# EAGLE design balance (EAGLE 6.5.0)
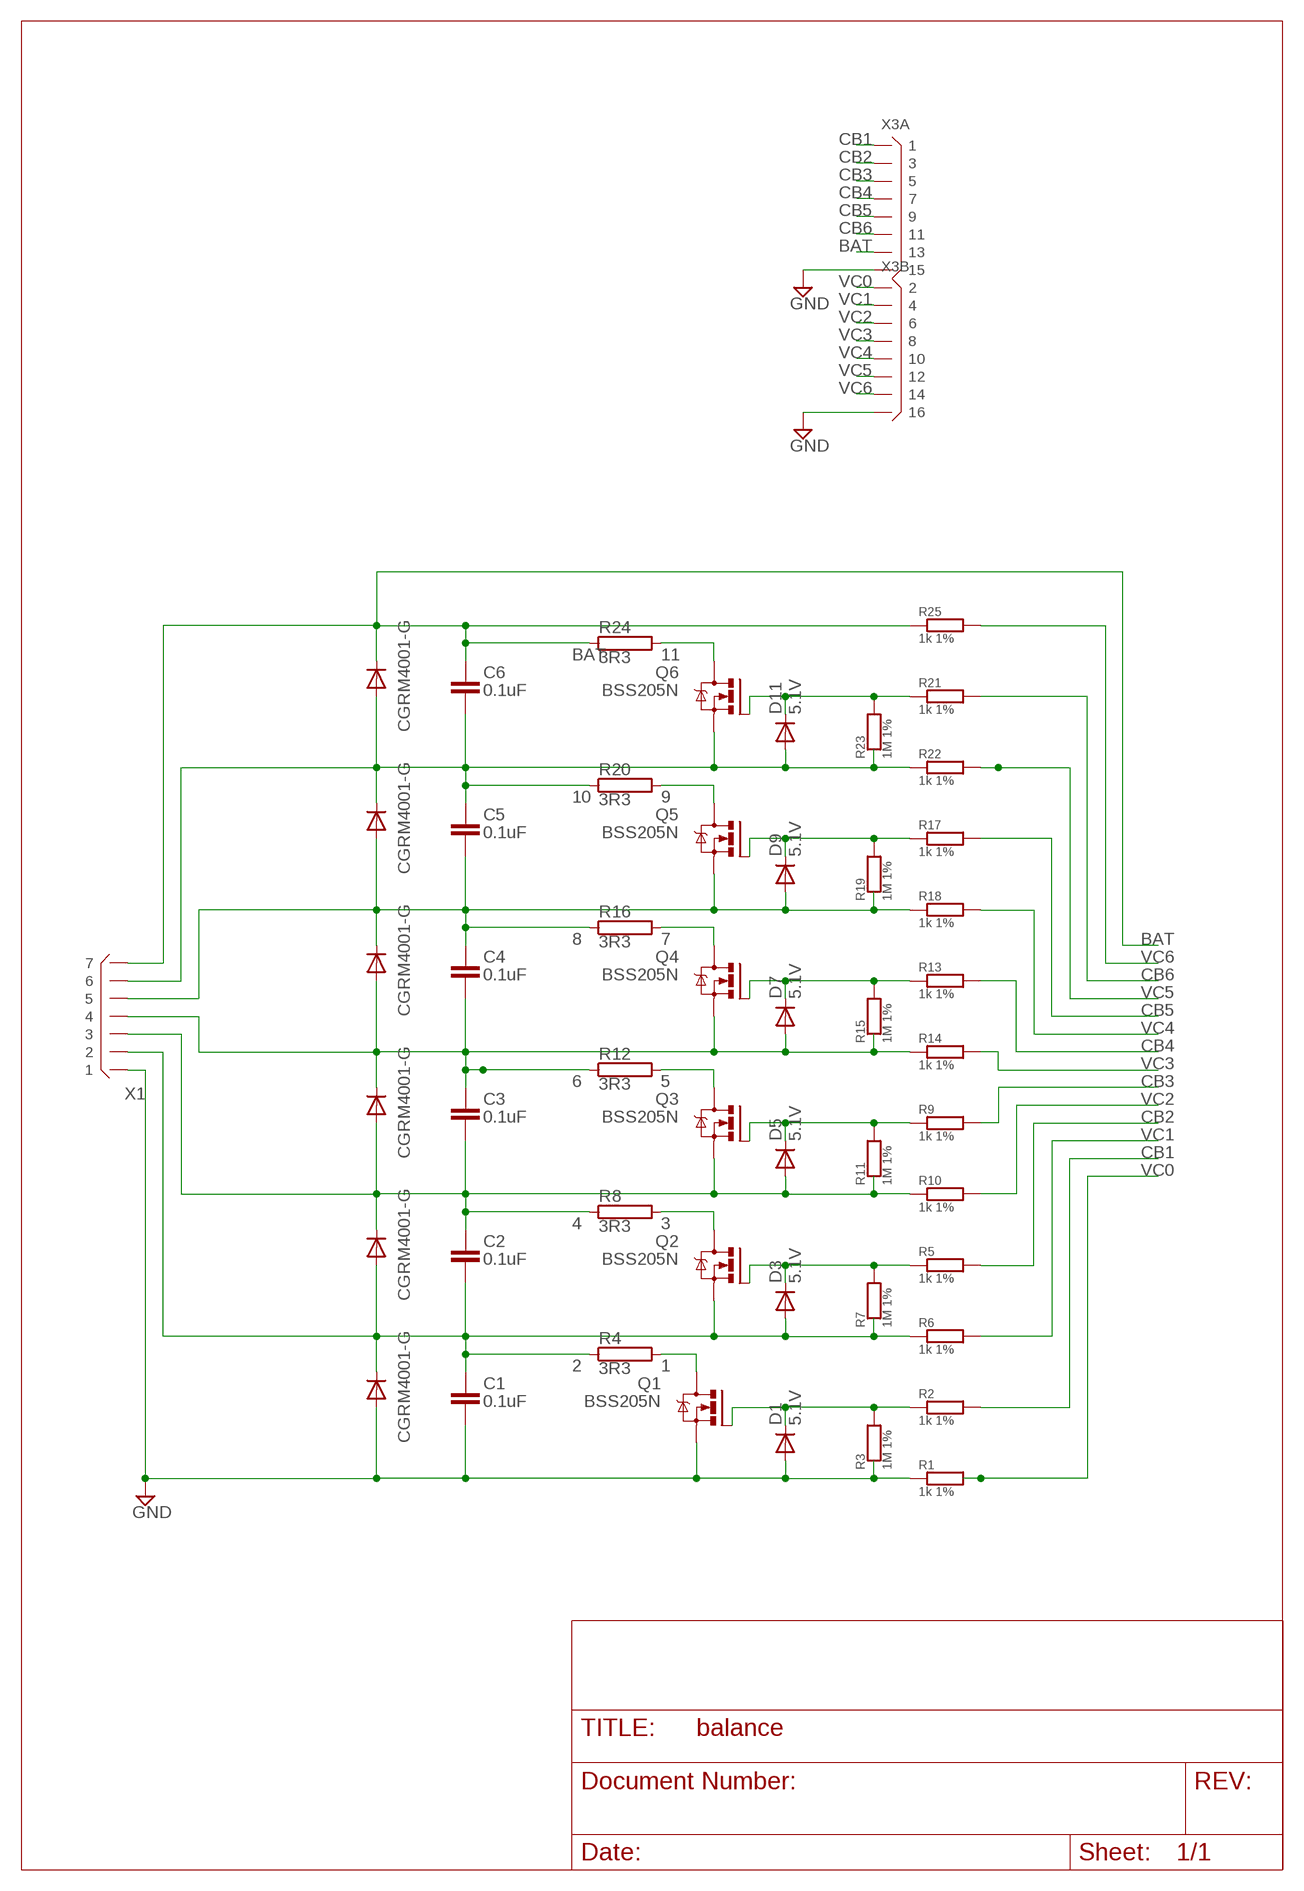
[diagram p0: schematic, sheet 1]

## Parts
C1  0.1uF  CSTD  [C0805]
C2  0.1uF  CSTD  [C0805]
C3  0.1uF  CSTD  [C0805]
C4  0.1uF  CSTD  [C0805]
C5  0.1uF  CSTD  [C0805]
C6  0.1uF  CSTD  [C0805]
D1  5.1V  DIODESOD  [SOD-323]
D2  CGRM4001-G  [SOD-123_MINI-SMA]
D3  5.1V  DIODESOD  [SOD-323]
D4  CGRM4001-G  [SOD-123_MINI-SMA]
D5  5.1V  DIODESOD  [SOD-323]
D6  CGRM4001-G  [SOD-123_MINI-SMA]
D7  5.1V  DIODESOD  [SOD-323]
D8  CGRM4001-G  [SOD-123_MINI-SMA]
D9  5.1V  DIODESOD  [SOD-323]
D10  CGRM4001-G  [SOD-123_MINI-SMA]
D11  5.1V  DIODESOD  [SOD-323]
D12  CGRM4001-G  [SOD-123_MINI-SMA]
Q1  BSS205N  [SOT23]
Q2  BSS205N  [SOT23]
Q3  BSS205N  [SOT23]
Q4  BSS205N  [SOT23]
Q5  BSS205N  [SOT23]
Q6  BSS205N  [SOT23]
R1  1k 1%  R  [R0805]
R2  1k 1%  R  [R0805]
R3  1M 1%  R  [R0805]
R4  3R3  R  [HS15]
R5  1k 1%  R  [R0805]
R6  1k 1%  R  [R0805]
R7  1M 1%  R  [R0805]
R8  3R3  R  [HS15]
R9  1k 1%  R  [R0805]
R10  1k 1%  R  [R0805]
R11  1M 1%  R  [R0805]
R12  3R3  R  [HS15]
R13  1k 1%  R  [R0805]
R14  1k 1%  R  [R0805]
R15  1M 1%  R  [R0805]
R16  3R3  R  [HS15]
R17  1k 1%  R  [R0805]
R18  1k 1%  R  [R0805]
R19  1M 1%  R  [R0805]
R20  3R3  R  [HS15]
R21  1k 1%  R  [R0805]
R22  1k 1%  R  [R0805]
R23  1M 1%  R  [R0805]
R24  3R3  R  [HS15]
R25  1k 1%  R  [R0805]
X1  B7B-XH  [B7B-XH]
X3  X08X2DR  [X16R-DIL]

## Nets
1: Q1.3(D) R4.2
2: C1.2 C2.1 D2.C D3.2(A) D4.A Q2.2(S) R4.1 R6.1 R7.1 X1.P$2
3: Q2.3(D) R8.2
4: C2.2 C3.1 D4.C D5.2(A) D6.A Q3.2(S) R8.1 R10.1 R11.1 X1.P$3
5: Q3.3(D) R12.2
6: C3.2 C4.1 D6.C D7.2(A) D8.A Q4.2(S) R12.1 R14.1 R15.1 X1.P$4
7: Q4.3(D) R16.2
8: C4.2 C5.1 D8.C D9.2(A) D10.A Q5.2(S) R16.1 R18.1 R19.1 X1.P$5
9: Q5.3(D) R20.2
10: C5.2 C6.1 D10.C D11.2(A) D12.A Q6.2(S) R20.1 R22.1 R23.1 X1.P$6
11: Q6.3(D) R24.2
BAT: C6.2 D12.C R24.1 R25.1 X1.P$7 X3.13
CB1: R2.2 X3.1
CB2: R5.2 X3.3
CB3: R9.2 X3.5
CB4: R13.2 X3.7
CB5: R17.2 X3.9
CB6: R21.2 X3.11
GND: C1.1 D1.2(A) D2.A Q1.2(S) R1.1 R3.1 X1.P$1 X3.15 X3.16
N$2: D1.1(C) Q1.1(G) R2.1 R3.2
N$4: D3.1(C) Q2.1(G) R5.1 R7.2
N$8: D5.1(C) Q3.1(G) R9.1 R11.2
N$12: D7.1(C) Q4.1(G) R13.1 R15.2
N$17: D9.1(C) Q5.1(G) R17.1 R19.2
N$21: D11.1(C) Q6.1(G) R21.1 R23.2
VC0: R1.2 X3.2
VC1: R6.2 X3.4
VC2: R10.2 X3.6
VC3: R14.2 X3.8
VC4: R18.2 X3.10
VC5: R22.2 X3.12
VC6: R25.2 X3.14

## Library data of the parts
C1-C6 = useful:C
D1 D3 D5 D7 D9 D11 = SparkFun:DIODE: Diode These are standard reverse protection diodes and small signal diodes. SMA package can handle up to about 1A. SOD-323 can handle about 200mA. What the SOD-323 package when ordering, there are some mfgs out there that are 5-pin packages.
D2 D4 D6 D8 D10 D12 = diode:CGRM400*-G: Molded plasitc,JEDEC SOD-123/Mini SMA Source: Comchip CGRM4001-G.pdf
Q1-Q6 = infineon:BSS205N: Infineon Small Signal Transistor, OptiMOS 2 Technology, 20V, 2.5A SOT23
R1-R3 R5-R7 R9-R11 R13-R15 R17-R19 R21-R23 R25 = useful:R
R4 R8 R12 R16 R20 R24 = special:R
X1 = con-jst-xh:?7B-XH
X3 = connectors:X08X2: Connector 2x8 pins

## Board
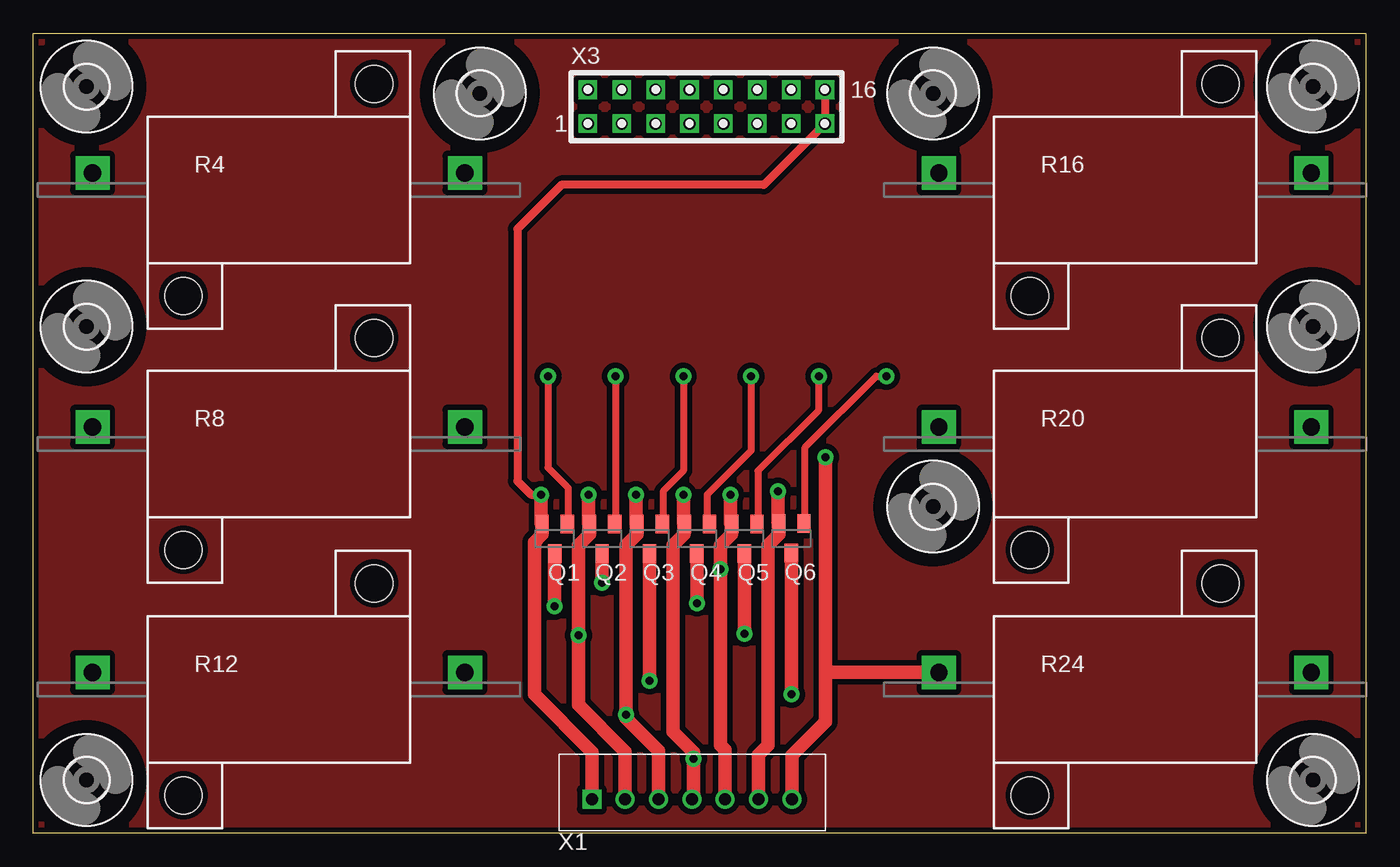
[diagram p1: board, top side]
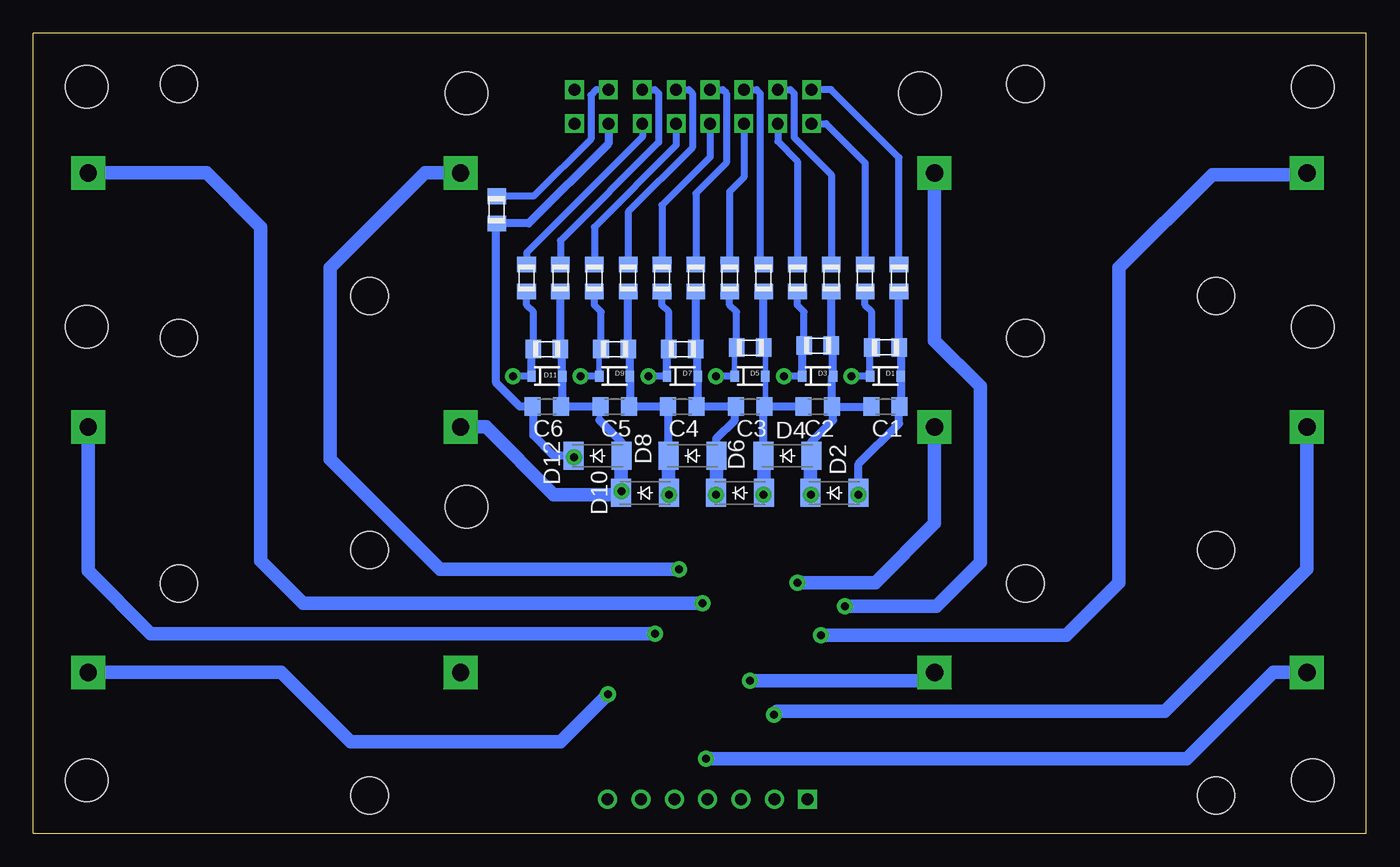
[diagram p2: board, bottom side, seen from below]

Size 100 x 60 mm. Coordinates in mm from the lower left corner, seen from the top.
Outline: 0,0 0,60 100,60 100,0 0,0
Copper layers (1+2*15+16): Top 0.035mm / dielectric 0.2mm / Route2 0.035mm / dielectric 0.5mm / Route15 0.035mm / dielectric 0.2mm / Bottom 0.035mm
Design rules "ats_35u_4layer_2 *": minimum track width 10mil, minimum drill 0.2mm, track to track 10mil, track to pad 10mil, pad to pad 10mil, via to via 10mil, smd to smd 10mil, copper to edge 0.3mm, drill to drill 8mil, minimum pad ring 10mil, minimum via ring 0.2mm, stop-mask expansion 4mil, vias tented up to drill 0mil, thermal gap 10mil

### Footprints (pad centres in the part's own frame; a part is rotated, then mirrored left to right if it is on the bottom)
C0805 = smd 1.2 x 1.4: 1 -1.066,0; 2 1.066,0
SOD-323 = smd 0.63 x 0.83: 1 -1.15,0; 2 1.15,0
SOD-123_MINI-SMA = smd 1.5 x 2.1: A 1.8,0; C -1.8,0
SOT23 = smd 1 x 1.4: 1 -0.95,-1.1; 2 0.95,-1.1; 3 0,1.1
R0805 = smd 1.168 x 1.397: 1 -1.016,0; 2 1.016,0
HS15 = drill 1.3 pad 2.54 square: 1 -13.97,1.27; 2 13.97,1.27 | hole 2.8: -7.15,-7.95; 7.15,7.95
3,2 = hole 3.2: 0,0
B7B-XH = drill 0.9 pad 1.422 square: P$1 0,0 | drill 0.9 pad 1.422: P$2 2.5,0; P$3 5,0; P$4 7.5,0; P$5 10,0; P$6 12.5,0; P$7 15,0
X16R-DIL = drill 0.889 pad 1.397 square: 1 -8.89,-1.27; 2 -8.89,1.27; 3 -6.35,-1.27; 4 -6.35,1.27; 5 -3.81,-1.27; 6 -3.81,1.27; 7 -1.27,-1.27; 8 -1.27,1.27; 9 1.27,-1.27; 10 1.27,1.27; 11 3.81,-1.27; 12 3.81,1.27; 13 6.35,-1.27; 14 6.35,1.27; 15 8.89,-1.27; 16 8.89,1.27

### Placement (x,y rotation side)
C1  36.07,32 180 bottom
C2  41.15,32 180 bottom
C3  46.23,32 180 bottom
C4  51.31,32 180 bottom
C5  56.39,32 180 bottom
C6  61.47,32 180 bottom
D1  36.07,34.29 0 bottom
D2  39.88,25.53 0 bottom
D3  41.15,34.29 0 bottom
D4  43.43,28.32 0 bottom
D5  46.23,34.29 0 bottom
D6  46.99,25.53 0 bottom
D7  51.31,34.29 0 bottom
D8  50.55,28.32 0 bottom
D9  56.39,34.29 0 bottom
D10  54.1,25.53 0 bottom
D11  61.47,34.29 0 bottom
D12  57.66,28.32 0 bottom
Q1  39.12,22.1 180 top
Q2  42.67,22.1 180 top
Q3  46.23,22.1 180 top
Q4  49.78,22.1 180 top
Q5  53.34,22.1 180 top
Q6  56.87,22.13 180 top
R1  35.05,41.66 90 bottom
R2  37.59,41.66 90 bottom
R3  36.07,36.45 180 bottom
R4  18.41,48.26 0 top
R5  42.67,41.66 90 bottom
R6  40.13,41.66 90 bottom
R7  41.15,36.58 180 bottom
R8  18.41,29.21 0 top
R9  47.75,41.66 90 bottom
R10  45.21,41.66 90 bottom
R11  46.22,36.44 180 bottom
R12  18.41,10.79 0 top
R13  52.83,41.66 90 bottom
R14  50.29,41.66 90 bottom
R15  51.31,36.32 180 bottom
R16  81.92,48.26 0 top
R17  57.91,41.66 90 bottom
R18  55.37,41.66 90 bottom
R19  56.39,36.32 180 bottom
R20  81.92,29.21 0 top
R21  62.99,41.66 90 bottom
R22  60.45,41.66 90 bottom
R23  61.47,36.32 180 bottom
R24  81.92,10.79 0 top
R25  65.24,46.77 90 bottom
U$1  [3,2]  4,4 0 top
U$2  [3,2]  4,56 0 top
U$3  [3,2]  96,4 0 top
U$4  [3,2]  96,56 0 top
U$5  [3,2]  67.5,55.5 0 top
U$6  [3,2]  33.5,55.5 0 top
U$7  [3,2]  67.5,24.5 0 top
U$8  [3,2]  4,38 0 top
U$9  [3,2]  96,38 0 top
X1  41.91,2.54 0 top
X3  50.5,54.5 0 top

### Tracks (layer width: path | path; a pad name or v marks a point on that pad's centre or on a via)
1  (via drill 0.6)
  Top 1.016: Q1.3 v39.12,17.02
  Bottom 1.016: v39.12,17.02 32.26,17.02 28.96,20.32 28.96,33.53 32.38,36.96 R4.2
2  (via drill 0.6)
  Top 1.016: v41.66,25.4 41.66,23.26 Q2.2 41.72,22.42 40.89,21.59 v40.89,14.86 40.89,9.65 44.41,6.14 X1.P$2
  Bottom 0.406: 40,36.44 R7.1 | 41.59,25.44 D2.C | 41.68,28.28 D4.A | 40.01,31.93 C2.1 | 40.08,34.21 D3.2
  Bottom 0.508: 41.59,25.44 41.62,25.44 v41.66,25.4
  Bottom 0.61: R7.1 R6.1 | D3.2 40,36.44 | C1.2 C2.1 40.08,34.21 | D4.A 41.63,29.36 40.01,30.99 40.01,31.93
  Bottom 1.016: D2.C 41.68,28.28 | v40.89,14.86 22.48,14.86 18.54,18.8 18.54,42.42 11.56,49.4 4.57,49.4 R4.1
3  (via drill 0.6)
  Top 1.016: Q2.3 v42.67,18.8
  Bottom 1.016: v42.67,18.8 36.83,18.8 32.38,23.24 R8.2
4  (via drill 0.6)
  Top 1.016: v45.21,25.4 45.21,23.26 Q3.2 45.28,22.42 44.45,21.59 v44.45,8.89 44.45,8.64 46.91,6.18 X1.P$3
  Bottom 0.406: R11.1 45.08,36.31 D5.2 45.08,32.09 C3.1 45.23,31.93 | 45.19,28.28 D4.C
  Bottom 0.508: D6.A 45.19,25.42 v45.21,25.4 | 45.21,40.89 45.21,40.88 R10.1
  Bottom 0.61: R11.1 45.21,40.89 | C2.2 C3.1 | D4.C 45.23,31.93
  Bottom 1.016: D6.A 45.19,28.28 | v44.45,8.89 44.2,9.14 15.11,9.14 4.45,19.81 R8.1
5  (via drill 0.6)
  Top 1.016: Q3.3 v46.23,11.43
  Bottom 1.016: v46.23,11.43 33.02,11.43 R12.2
6  (via drill 0.6)
  Top 1.016: v48.77,25.4 48.77,23.26 Q4.2 48.83,22.42 48.01,21.59 48.01,7.62 49.53,6.1 v49.53,5.59 49.53,2.66 X1.P$4
  Bottom 0.406: 50.16,36.19 R15.1 | 50.16,32.09 C4.1 | 48.75,25.57 D6.C | 47.37,31.93 C3.2
  Bottom 0.508: D6.C 48.79,25.42 v48.77,25.4
  Bottom 0.61: R15.1 R14.1 | 50.16,36.19 D7.2 50.16,32.09 | C3.2 C4.1 | D8.A 48.75,29.61 47.37,30.99 47.37,31.93
  Bottom 1.016: D8.A 48.75,25.57 | v49.53,5.59 13.46,5.59 6.99,12.06 R12.1
7  (via drill 0.6)
  Top 1.016: Q4.3 v49.78,17.27
  Bottom 1.016: v49.78,17.27 79.76,17.27 82.93,20.45 82.93,45.47 87,49.53 R16.2
8  (via drill 0.6)
  Top 1.016: v52.32,25.4 52.32,23.26 Q5.2 52.39,22.42 51.56,21.59 v51.56,19.81 51.56,6.6 51.91,6.26 X1.P$5
  Bottom 0.406: 55.24,36.19 R19.1 | 55.24,32.09 C5.1 | 52.35,31.98 C4.2
  Bottom 0.508: v52.32,25.4 52.3,25.42 D10.A 52.35,25.57 52.35,25.82
  Bottom 0.61: R19.1 R18.1 | 55.24,36.19 D9.2 55.24,32.09 | C4.2 C5.1 | D8.C 52.35,31.98
  Bottom 1.016: D8.C 52.35,25.82 | R16.1 70.61,49.53 77.72,42.42 77.72,28.07 69.47,19.81 v51.56,19.81
9  (via drill 0.6)
  Top 1.016: Q5.3 v53.34,14.99
  Bottom 1.016: v53.34,14.99 91.19,14.99 95.89,19.68 R20.2
10  (via drill 0.6)
  Top 0.406: Q6.2 55.88,23.23 55.88,23.39
  Top 1.016: v55.88,25.65 55.88,23.39 | X1.P$6 54.41,5.9 55.12,6.6 55.12,21.59 55.95,22.42 55.95,23.23 Q6.2
  Bottom 0.406: 60.32,36.19 R23.1 | 60.32,32.09 C6.1 | 55.9,28.28 D12.A | 55.81,25.44 D10.C | 57.53,30.99 57.53,31.93 C5.2
  Bottom 0.508: 55.81,25.44 55.81,25.59 v55.88,25.65
  Bottom 0.61: R23.1 R22.1 | 60.32,36.19 D11.2 60.32,32.09 | C5.2 C6.1 | D12.A 55.86,29.32 57.53,30.99
  Bottom 1.016: 55.9,28.28 D10.C 56.03,25.4 60.96,25.4 66.04,30.48 R20.1
11  (via drill 0.6)
  Top 1.016: Q6.3 56.87,10.44 v56.9,10.41
  Bottom 1.016: v56.9,10.41 60.45,6.86 76.2,6.86 81.41,12.06 R24.2
BAT  (via drill 0.6)
  Top 1.016: v59.44,28.19 59.44,12.06 | 59.44,12.06 59.44,8.38 56.91,5.86 X1.P$7 | R24.1 59.44,12.06
  Bottom 0.406: 62.48,31.95 C6.2
  Bottom 0.508: R25.1 65.28,45.71 65.28,45.46
  Bottom 0.61: C6.2 63.5,32 65.28,33.78 65.28,45.46 | D12.C 60.96,28.32 62.48,29.84 62.48,31.95 | X3.13 56.85,51.73 62.83,45.75 R25.1
  Bottom 1.016: D12.C 59.44,28.3 v59.44,28.19
CB1
  Bottom 0.508: X3.1 40.53,53.23 37.59,50.29 R2.2
CB2
  Bottom 0.508: X3.3 44.15,51.9 42.67,50.42 R5.2
CB3
  Bottom 0.508: X3.5 46.69,49.2 47.75,48.13 R9.2
CB4
  Bottom 0.508: X3.7 49.23,50.72 52.83,47.12 R13.2
CB5
  Bottom 0.508: X3.9 51.77,51.61 57.91,45.47 R17.2
CB6
  Bottom 0.508: X3.11 54.31,52.24 62.99,43.56 R21.2
GND  (via drill 0.6)
  Top 0.61: X3.16 X3.15 54.8,48.64 39.62,48.64 36.32,45.34 36.32,26.42 37.34,25.4 v38.1,25.4
  Top 1.016: v38.1,25.4 38.1,23.26 Q1.2 38.17,22.42 37.59,21.84 37.59,10.41 41.91,6.1 X1.P$1
  Bottom 0.406: 34.92,32.09 C1.1 35.05,31.95 | 38.03,25.48 D2.A
  Bottom 0.508: 38.03,25.48 38.03,25.47 v38.1,25.4 | 34.92,36.44 34.92,36.45 R3.1
  Bottom 0.61: R3.1 R1.1 | 34.92,36.44 D1.2 34.92,32.09 | D2.A 38.08,27.71 35.05,30.73 35.05,31.95
N$1
  pour Top (isolate 0.406): 0,60 100,60 100,0 0,0
N$2  (via drill 0.6)
  Top 0.406: Q1.1 40.13,23.26
  Top 0.508: v38.61,34.29 38.61,27.43 40.13,25.91 40.13,23.26
  Bottom 0.508: R2.1 37.59,39.62 37.08,39.12 R3.2 37.22,36.31 D1.1 v38.61,34.29
N$4  (via drill 0.6)
  Top 0.406: Q2.1 43.62,23.43 43.69,23.5
  Top 0.508: v43.69,34.29 43.69,23.5 43.69,23.26
  Bottom 0.406: 42.3,36.44 R7.2
  Bottom 0.508: R7.2 42.16,39.12 42.67,39.62 R5.1 | D3.1 v43.69,34.29
  Bottom 0.61: D3.1 42.3,36.44
N$8  (via drill 0.6)
  Top 0.406: Q3.1 47.18,23.3 47.24,23.37
  Top 0.508: v48.77,34.29 48.77,27.18 47.24,25.65 47.24,23.37 47.24,23.26
  Bottom 0.406: D5.1 47.38,36.3 R11.2
  Bottom 0.508: R11.2 47.24,39.11 47.75,39.62 R9.1 | D5.1 v48.77,34.29
N$12  (via drill 0.6)
  Top 0.406: Q4.1 50.55,23.39
  Top 0.508: v53.85,34.29 53.85,28.7 50.55,25.4 50.55,23.39
  Bottom 0.406: 52.46,36.19 R15.2
  Bottom 0.508: R15.2 52.32,39.12 52.83,39.62 R13.1 | D7.1 v53.85,34.29
  Bottom 0.61: D7.1 52.46,36.19
N$17  (via drill 0.6)
  Top 0.406: 54.36,23.26 Q5.1
  Top 0.508: 54.36,23.26 54.36,27.18 58.93,31.75 v58.93,34.29
  Bottom 0.406: D9.1 57.54,36.19 R19.2
  Bottom 0.508: R19.2 57.4,39.12 57.91,39.62 R17.1 | D9.1 v58.93,34.29
N$21  (via drill 0.6)
  Top 0.406: Q6.1 57.88,23.23 57.91,23.26
  Top 0.508: 57.91,23.26 57.91,28.96 63.25,34.29 v64.01,34.29
  Bottom 0.406: 62.62,36.19 R23.2
  Bottom 0.508: R23.2 62.48,39.12 62.99,39.62 R21.1 | D11.1 v64.01,34.29
  Bottom 0.61: D11.1 62.62,36.19
VC0
  Bottom 0.508: R1.2 35.05,50.67 40.15,55.77 X3.2
VC1
  Bottom 0.508: X3.4 43.2,55.77 42.93,55.5 42.93,52.2 40.13,49.4 R6.2
  Bottom 0.61: 40.11,42.69 R6.2
VC2
  Bottom 0.508: X3.6 45.74,55.77 45.47,55.5 45.47,42.93 R10.2
VC3
  Bottom 0.508: X3.8 48.28,55.77 48.01,55.5 48.01,50.29 50.29,48.01 R14.2
VC4
  Bottom 0.508: X3.10 50.82,55.77 50.55,55.5 50.55,51.44 55.37,46.61 R18.2
VC5
  Bottom 0.508: X3.12 53.36,55.77 53.09,55.5 53.09,51.82 60.45,44.45 R22.2
VC6
  Bottom 0.508: X3.14 57.77,55.77 58.17,55.37 58.17,52.07 62.45,47.78 R25.2

### Text on the board
tTest: 2,7A, 60V / 1783927 | Balancer V2 Moni | 1
bTest: bottom | 0.1uF | 5.1V, / 500mW